# Altium schematic sheet DAC_adacus_sch.SchDoc: DAC Schematic
size B; Date: 02/03/2024; Author: Turan Suleymanli; SheetNumber: 3; SheetTotal: 4; Time: 21:00
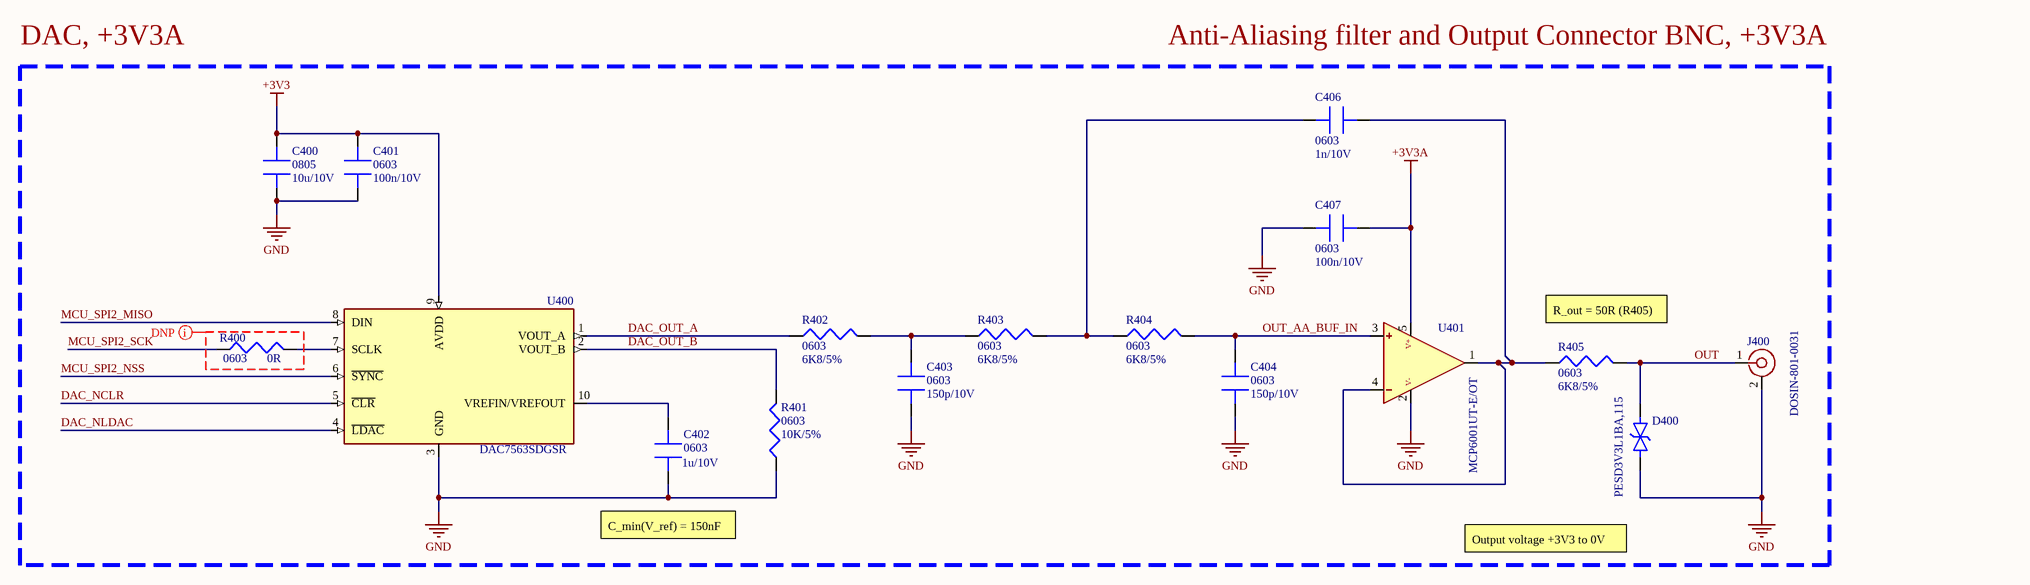
[diagram p0: DAC_adacus_sch.SchDoc]

## Parts
C400  value 10u/10V  Package: 0805  [[0805] CAPC2012X09M [A - LD]]  (hidden comment: Capacitor)
C401  value 100n/10V  Package: 0603  [[0603] CAPC1608X10M [A-LD]]  (hidden comment: Capacitor)
C402  value 1u/10V  Package: 0603  [[0603] CAPC1608X10M [A-LD]]  (hidden comment: Capacitor)
C403  value 150p/10V  Package: 0603  [[0603] CAPC1608X10M [A-LD]]  (hidden comment: Capacitor)
C404  value 150p/10V  Package: 0603  [[0603] CAPC1608X10M [A-LD]]  (hidden comment: Capacitor)
C406  value 1n/10V  Package: 0603  [[0603] CAPC1608X10M [A-LD]]  (hidden comment: Capacitor)
C407  value 100n/10V  Package: 0603  [[0603] CAPC1608X10M [A-LD]]  (hidden comment: Capacitor)
D400  PESD3V3L1BA,115  [SODFL250X110-2M]
J400  DOSIN-801-0031  [DOSIN8010031]
R400  value 0R  Package: 0603  [[0603] RESC1608X06M [A-LD]]  (hidden comment: Resistor)
R401  value 10K/5%  Package: 0603  [[0603] RESC1608X06M [A-LD]]  (hidden comment: Resistor)
R402  value 6K8/5%  Package: 0603  [[0603] RESC1608X06M [A-LD]]  (hidden comment: Resistor)
R403  value 6K8/5%  Package: 0603  [[0603] RESC1608X06M [A-LD]]  (hidden comment: Resistor)
R404  value 6K8/5%  Package: 0603  [[0603] RESC1608X06M [A-LD]]  (hidden comment: Resistor)
R405  value 6K8/5%  Package: 0603  [[0603] RESC1608X06M [A-LD]]  (hidden comment: Resistor)
U400  DAC7563SDGSR  [TSSOP50P490X110-10M]
U401  MCP6001UT-E/OT  [SOT95P270X145-5M]

## Nets
+3V3: C400.2 C401.2 U400.9(AVDD)
+3V3A: C407.1 U401.5(VDD)
GND: C400.1 C401.1 C402.1 C403.1 C404.1 C407.2 D400.1 J400.2 R401.2 U400.3(GND) U401.2(VSS)
DAC_NCLR: U400.5(~{CLR})
DAC_NLDAC: U400.4(~{LDAC})
DAC_OUT_A: R402.2 U400.1(VOUT_A)
DAC_OUT_B: R401.1 U400.2(VOUT_B)
MCU_SPI2_MISO: U400.8(DIN)
MCU_SPI2_NSS: U400.6(~{SYNC})
MCU_SPI2_SCK: R400.2
OUT: D400.2 J400.1 R405.1
OUT_AA_BUF_IN: C404.2 R404.1 U401.3(+)
NetC402_2: C402.2 U400.10(VREFIN/VREFOUT)
NetC403_2: C403.2 R402.1 R403.2
NetC406_1: C406.1 R405.2 U401.1(OUT) U401.4(-)
NetC406_2: C406.2 R403.1 R404.2
NetR400_1: R400.1 U400.7(SCLK)

## Layout directives
mark named DNP: (no net found under the mark)

## Notes on the sheet
- DAC, +3V3A
- Anti-Aliasing filter and Output Connector BNC, +3V3A
- (near R405) R_out = 50R (R405)
- (near C402) C_min(V_ref) = 150nF
- Output voltage +3V3 to 0V
- (in symbol MCP6001UT-E/OT) V+; V-

## Library data of the parts
C400-C404 C406 C407 = Capacitor: Standard Capacitor
D400 = PESD3V3L1BA,115: ESD Suppressors / TVS Diodes PESD3V3L1BA/SOD323/SOD2; Supplier Link: https://www.mouser.pl/ProductDetail/Nexperia/PESD3V3L1BA115?qs=LOCUfHb8d9tfcQwAsqvzKg%3D%3D; Datasheet: https://www.mouser.pl/datasheet/2/916/PESD3V3L1BA-3162553.pdf
J400 = BNC Connector: BNC Board Edge Bend 9.6mm Plugin RF Connectors / Coaxial Connectors
R400-R405 = Resistor: Standard Resistor
U400 = DAC7563SDGSR: Digital to Analog Converters - DAC 12B,Dual,Lo Pwr Ultra-Lo Glitch DAC; Supplier Link: https://eu.mouser.com/ProductDetail/Texas-Instruments/DAC7563SDGSR?qs=QtI0yD1FyOPUuM44rgyQjg%3D%3D; Datasheet: https://www.ti.com/lit/ds/symlink/dac8162.pdf?ts=1704273536554
U401 = MCP6001UT-E/OT: Operational Amplifiers - Op Amps Single 1.8V 1MHz; Supplier: https://eu.mouser.com/ProductDetail/Microchip-Technology/MCP6001UT-I-OT?qs=Sez7gRs8XSU2iw24kVuIOw%3D%3D; Datasheet: https://eu.mouser.com/datasheet/2/268/MCHP_S_A0009381759_1-2520804.pdf